# Altium schematic sheet 04_CONNECTOR_OUT.SchDoc
size 420 x 297 mm; SheetNumber: 6; SheetTotal: 24
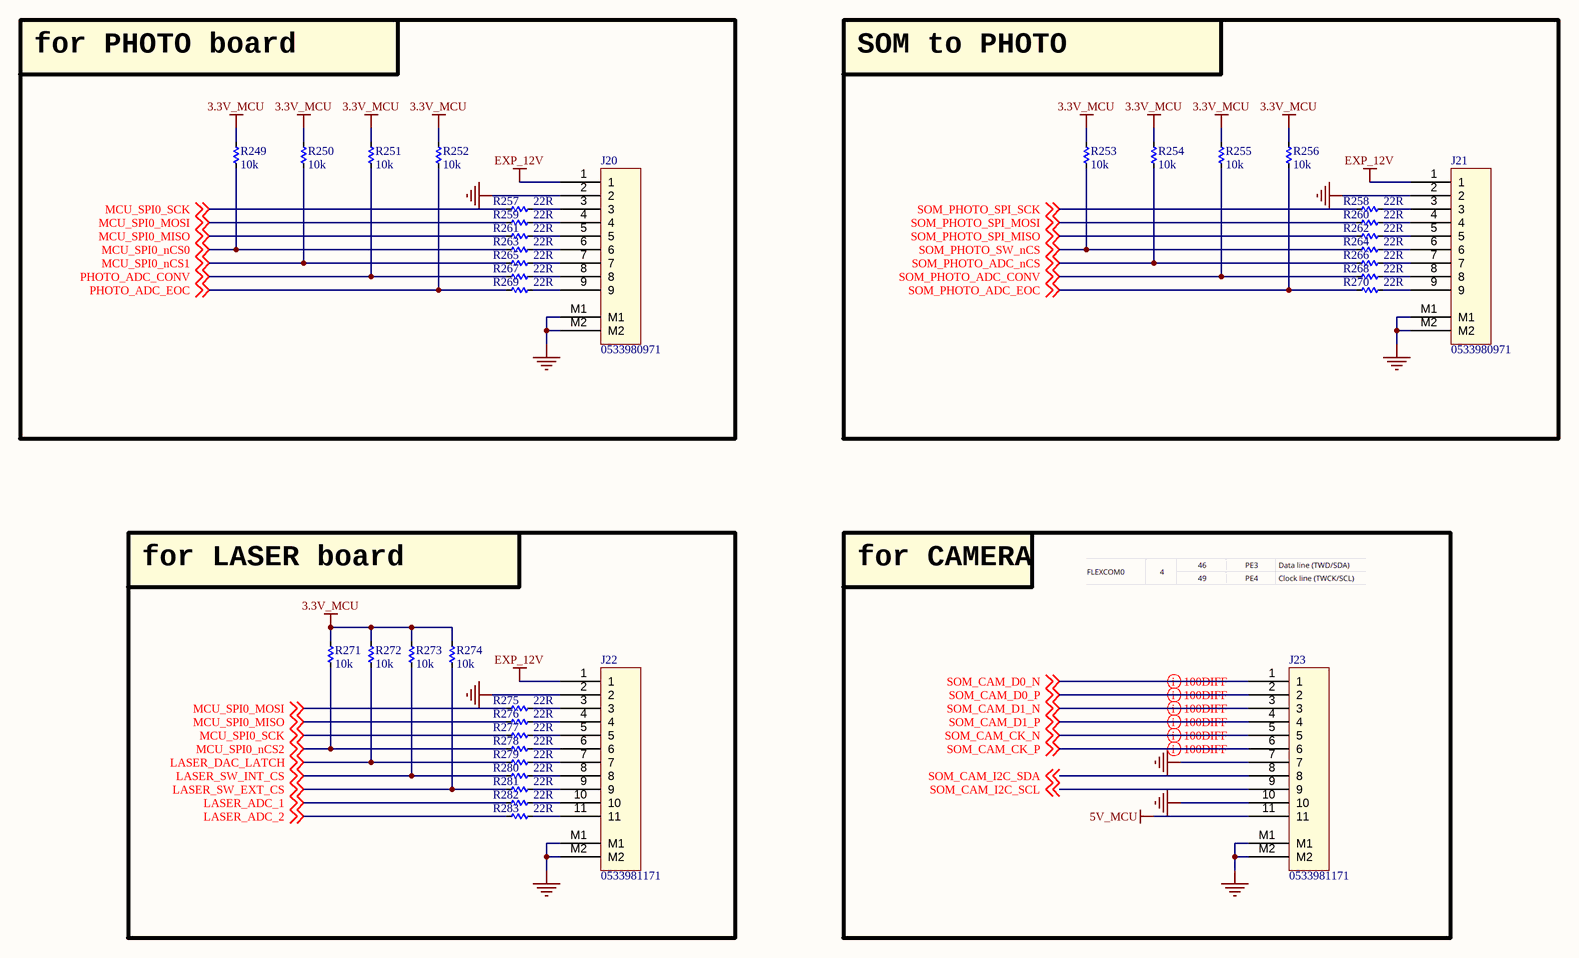
[diagram p0: 04_CONNECTOR_OUT.SchDoc]

## Parts
J20  0533980971  [MOLEX_0533980971]
J21  0533980971  [MOLEX_0533980971]
J22  0533981171  [MOLEX_0533981171]
J23  0533981171
R249  10k  [RES_C_1005X40]
R250  10k  [RES_C_1005X40]
R251  10k  [RES_C_1005X40]
R252  10k  [RES_C_1005X40]
R253  10k  [RES_C_1005X40]
R254  10k  [RES_C_1005X40]
R255  10k  [RES_C_1005X40]
R256  10k  [RES_C_1005X40]
R257  22R  [RES_C_1005X40]
R258  22R  [RES_C_1005X40]
R259  22R  [RES_C_1005X40]
R260  22R  [RES_C_1005X40]
R261  22R  [RES_C_1005X40]
R262  22R  [RES_C_1005X40]
R263  22R  [RES_C_1005X40]
R264  22R  [RES_C_1005X40]
R265  22R  [RES_C_1005X40]
R266  22R  [RES_C_1005X40]
R267  22R  [RES_C_1005X40]
R268  22R  [RES_C_1005X40]
R269  22R  [RES_C_1005X40]
R270  22R  [RES_C_1005X40]
R271  10k  [RES_C_1005X40]
R272  10k  [RES_C_1005X40]
R273  10k  [RES_C_1005X40]
R274  10k  [RES_C_1005X40]
R275  22R  [RES_C_1005X40]
R276  22R  [RES_C_1005X40]
R277  22R  [RES_C_1005X40]
R278  22R  [RES_C_1005X40]
R279  22R  [RES_C_1005X40]
R280  22R  [RES_C_1005X40]
R281  22R  [RES_C_1005X40]
R282  22R  [RES_C_1005X40]
R283  22R  [RES_C_1005X40]

## Blocks framed on the sheet
for PHOTO board: J20 R249-R252 R257 R259 R261 R263 R265 R267 R269
SOM to PHOTO: J21 R253-R256 R258 R260 R262 R264 R266 R268 R270
for LASER board: J22 R271-R283
for CAMERA: J23

## Nets
3.3V_MCU: R249.1 R250.1 R251.1 R252.1 R253.1 R254.1 R255.1 R256.1 R271.1 R272.1 R273.1 R274.1
5V_MCU: J23.11
EXP_12V: J20.1 J21.1 J22.1
GND: J20.2 J20.M1 J20.M2 J21.2 J21.M1 J21.M2 J22.2 J22.M1 J22.M2 J23.7 J23.10 J23.M1 J23.M2
LASER_ADC_1: R282.1 ; off-sheet LASER_ADC_1
LASER_ADC_2: R283.1 ; off-sheet LASER_ADC_2
LASER_DAC_LATCH: R272.2 R279.1 ; off-sheet LASER_DAC_LATCH
LASER_SW_EXT_CS: R274.2 R281.1 ; off-sheet LASER_SW_EXT_CS
LASER_SW_INT_CS: R273.2 R280.1 ; off-sheet LASER_SW_INT_CS
MCU_SPI0_MISO: R261.1 R276.1 ; off-sheet MCU_SPI0_MISO
MCU_SPI0_MOSI: R259.1 R275.1 ; off-sheet MCU_SPI0_MOSI
MCU_SPI0_nCS0: R249.2 R263.1 ; off-sheet MCU_SPI0_nCS0
MCU_SPI0_nCS1: R250.2 R265.1 ; off-sheet MCU_SPI0_nCS1
MCU_SPI0_nCS2: R271.2 R278.1 ; off-sheet MCU_SPI0_nCS2
MCU_SPI0_SCK: R257.1 R277.1 ; off-sheet MCU_SPI0_SCK
PHOTO_ADC_CONV: R251.2 R267.1 ; off-sheet PHOTO_ADC_CONV
PHOTO_ADC_EOC: R252.2 R269.1 ; off-sheet PHOTO_ADC_EOC
SOM_CAM_CK_N: J23.5 ; off-sheet SOM_CAM_CK_N
SOM_CAM_CK_P: J23.6 ; off-sheet SOM_CAM_CK_P
SOM_CAM_D0_N: J23.1 ; off-sheet SOM_CAM_D0_N
SOM_CAM_D0_P: J23.2 ; off-sheet SOM_CAM_D0_P
SOM_CAM_D1_N: J23.3 ; off-sheet SOM_CAM_D1_N
SOM_CAM_D1_P: J23.4 ; off-sheet SOM_CAM_D1_P
SOM_CAM_I2C_SCL: J23.9 ; off-sheet SOM_CAM_I2C_SCL
SOM_CAM_I2C_SDA: J23.8 ; off-sheet SOM_CAM_I2C_SDA
SOM_PHOTO_ADC_CONV: R255.2 R268.1 ; off-sheet SOM_PHOTO_ADC_CONV
SOM_PHOTO_ADC_EOC: R256.2 R270.1 ; off-sheet SOM_PHOTO_ADC_EOC
SOM_PHOTO_ADC_nCS: R254.2 R266.1 ; off-sheet SOM_PHOTO_ADC_nCS
SOM_PHOTO_SPI_MISO: R262.1 ; off-sheet SOM_PHOTO_SPI_MISO
SOM_PHOTO_SPI_MOSI: R260.1 ; off-sheet SOM_PHOTO_SPI_MOSI
SOM_PHOTO_SPI_SCK: R258.1 ; off-sheet SOM_PHOTO_SPI_SCK
SOM_PHOTO_SW_nCS: R253.2 R264.1 ; off-sheet SOM_PHOTO_SW_nCS
NetJ20_3: J20.3 R257.2
NetJ20_4: J20.4 R259.2
NetJ20_5: J20.5 R261.2
NetJ20_6: J20.6 R263.2
NetJ20_7: J20.7 R265.2
NetJ20_8: J20.8 R267.2
NetJ20_9: J20.9 R269.2
NetJ21_3: J21.3 R258.2
NetJ21_4: J21.4 R260.2
NetJ21_5: J21.5 R262.2
NetJ21_6: J21.6 R264.2
NetJ21_7: J21.7 R266.2
NetJ21_8: J21.8 R268.2
NetJ21_9: J21.9 R270.2
NetJ22_3: J22.3 R275.2
NetJ22_4: J22.4 R276.2
NetJ22_5: J22.5 R277.2
NetJ22_6: J22.6 R278.2
NetJ22_7: J22.7 R279.2
NetJ22_8: J22.8 R280.2
NetJ22_9: J22.9 R281.2
NetJ22_10: J22.10 R282.2
NetJ22_11: J22.11 R283.2

## Layout directives
differential pair; differential pair class DIFF100: SOM_CAM_CK_N, SOM_CAM_CK_P, SOM_CAM_D0_N, SOM_CAM_D0_P, SOM_CAM_D1_N, SOM_CAM_D1_P

## Notes on the sheet
- Project:
- BEE-PC1
- Sub-system:
- NANORACK_EXP_CONTROLLER
- Design by:
- SANG HUYNH
- BAO BUI Q.
- Sheet title:
- Sheet
- A3
- of
- Checked by:
- Approved by:
- VU PHAM
- Revision:
- Document No:
- V1.2.2
- Size:
- Date:

## Library data of the parts
J20 J21 = Header 9x1_2M
J22 J23 = Header 11x1_2M
R249-R283 = _RES_B_2: RES